# EAGLE design MK1 (EAGLE 9.6.2)

## Sheet 1 of 2
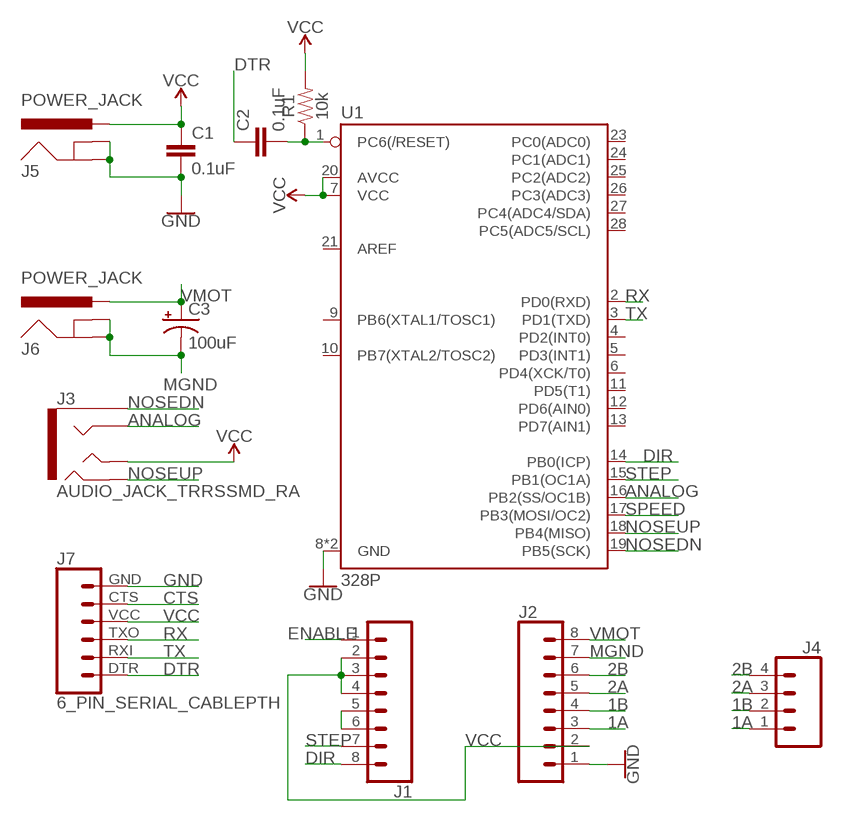
[diagram p0: schematic, sheet 1]

### Parts
C1  0.1uF  0.1UF-KIT-EZ-50V-20%  [CAP-PTH-SMALL-KIT]
C2  0.1uF  0.1UF-KIT-EZ-50V-20%  [CAP-PTH-SMALL-KIT]
C3  100uF  100UF-POLAR-RADIAL-2.5MM-25V-20%  [CPOL-RADIAL-2.5MM-6.5MM]
J1  CONN_08"  [1X08]
J2  CONN_08"  [1X08]
J3  AUDIO_JACK_TRRSSMD_RA  [AUDIO_JACK_3.5MM_TRRS_SMD_RA]
J4  CONN_04PTH  [1X04]
J5  POWER_JACK  [POWER_JACK_PTH]
J6  POWER_JACK  [POWER_JACK_PTH]
J7  6_PIN_SERIAL_CABLEPTH  [FTDI_BASIC]
R1  10k  10KOHM-HORIZ-1/4W-1%  [AXIAL-0.3]
U1  328P  ATMEGA328P_PDIP  [DIP28]

### Nets
1A: J2.3 J4.1
1B: J2.4 J4.2
2A: J2.5 J4.3
2B: J2.6 J4.4
ANALOG: J3.RING1 U1.16(PB2(SS/OC1B))
CTS: J7.CTS
DIR: J1.8 U1.14(PB0(ICP))
DTR: C2.1 J7.DTR
ENABLE: J1.1
GND: C1.2 J2.1 J5.GND J5.GNDBREAK J7.GND U1.8(GND) U1.22(GND)
MGND: C3.2(-) J2.7 J6.GND J6.GNDBREAK
N$1: C2.2 R1.P$1 U1.1(PC6(/RESET))
N$4: J1.5 J1.6
NOSEDN: J3.EARTH U1.19(PB5(SCK))
NOSEUP: J3.RING2 U1.18(PB4(MISO))
RX: J7.TXO U1.2(PD0(RXD))
SPEED: U1.17(PB3(MOSI/OC2))
STEP: J1.7 U1.15(PB1(OC1A))
TX: J7.RXI U1.3(PD1(TXD))
VCC: C1.1 J1.2 J1.3 J1.4 J2.2 J3.TIP J5.PWR J7.VCC R1.P$2 U1.7(VCC) U1.20(AVCC)
VMOT: C3.1(+) J2.8 J6.PWR
Unconnected: U1.4(PD2(INT0)) U1.5(PD3(INT1)) U1.6(PD4(XCK/T0)) U1.9(PB6(XTAL1/TOSC1)) U1.10(PB7(XTAL2/TOSC2)) U1.11(PD5(T1)) U1.12(PD6(AIN0)) U1.13(PD7(AIN1)) U1.21(AREF) U1.23(PC0(ADC0)) U1.24(PC1(ADC1)) U1.25(PC2(ADC2)) U1.26(PC3(ADC3)) U1.27(PC4(ADC4/SDA)) U1.28(PC5(ADC5/SCL))

## Sheet 2 of 2

## Library data of the parts
C1 C2 = SparkFun-Capacitors:0.1UF: 0.1µF ceramic capacitors A capacitor is a passive two-terminal electrical component used to store electrical energy temporarily in an electric field.; PROD_ID: CAP-08370
C3 = SparkFun-Capacitors:100UF-POLAR: 100µF polarized capacitors A capacitor is a passive two-terminal electrical component used to store electrical energy temporarily in an electric field.; PROD_ID: CAP-08439
J1 J2 = SparkFun-Connectors:CONN_08: Multi connection point. Often used as Generic Header-pin footprint for 0.1 inch spaced/style header connections On any of the 0.1 inch spaced packages, you can populate with these: Break Away Headers - Straight <https://www.sparkfun.com/products/116> (PRT-00116) Break Away Male Headers - Right Angle <https://www.sparkfun.com/products/553> (PRT-00553) Female Headers <https://www.sparkfun.com/products/115> (PRT-00115) Break Away Headers - Machine Pin <https://www.sparkfun.com/products/117> (PRT-00117) Break Away Female Headers - Swiss Machine Pin <https://www.sparkfun.com/products/743> (PRT-00743) Arduino Stackable Header - 8 Pin <https://www.sparkfun.com/products/9279> (PRT-09279) For SCREWTERMINALS and SPRING TERMINALS visit here: Screw Terimnals on SparkFun.com <https://www.sparkfun.com/search/results?term=Screw+Terminals> (5mm/3.5mm/2.54mm spacing) This device is also useful as a general connection point to wire up your design to another part of your project. Our various solder wires solder well into these plated through hole pads. Hook-Up Wire - Assortment (Stranded, 22 AWG) <https://www.sparkfun.com/products/11375> (PRT-11375) Hook-Up Wire - Assortment (Solid Core, 22 AWG) <https://www.sparkfun.com/products/11367> (PRT-11367) View the entire wire category on our website here <https://www.sparkfun.com/categories/141> Special notes: Molex polarized connector foot print use with SKU : PRT-08231 with associated crimp pins and housings. 1MM SMD Version SKU: PRT-10208 NOTES ON THE VARIANTS LOCK and LOCK_LONGPADS... This footprint was designed to help hold the alignment of a through-hole component (i.e. 6-pin header) while soldering it into place. You may notice that each hole has been shifted either up or down by 0.005 of an inch from it's more standard position (which is a perfectly straight line). This slight alteration caused the pins (the squares in the middle) to touch the edges of the holes. Because they are alternating, it causes a "brace" to hold the component in place. 0.005 has proven to be the perfect amount of "off-center" position when using our standard breakaway headers. Although looks a little odd when you look at the bare footprint, once you have a header in there, the alteration is very hard to notice. Also,if you push a header all the way into place, it is covered up entirely on the bottom side.; PROD_ID: CONN-08438
J3 = SparkFun-Connectors:AUDIO_JACK_TRRS: Audio Jack - 3.5mm TRRS (SMD) This is a 3.5mm TRRS SMD audio jack. TRRS connectors are the audio-style connectors that you see on some phones, MP3 players and development boards. TRRS stands for “tip, ring, ring, sleeve,” which reflects that this has three conductors and a ground. SparkFun Products: Audio Jack <https://www.sparkfun.com/products/12639> mbed Starter Kit <https://www.sparkfun.com/products/12968> SparkFun TRRS 3.5mm Jack Breakout <https://www.sparkfun.com/products/11570>; PROD_ID: CONN-10676; SF_ID: PRT-12639
J4 = SparkFun-Connectors:CONN_04: Multi connection point. Often used as Generic Header-pin footprint for 0.1 inch spaced/style header connections On any of the 0.1 inch spaced packages, you can populate with these: Break Away Headers - Straight <https://www.sparkfun.com/products/116> (PRT-00116) Break Away Male Headers - Right Angle <https://www.sparkfun.com/products/553> (PRT-00553) Female Headers <https://www.sparkfun.com/products/115> (PRT-00115) Break Away Headers - Machine Pin <https://www.sparkfun.com/products/117> (PRT-00117) Break Away Female Headers - Swiss Machine Pin <https://www.sparkfun.com/products/743> (PRT-00743) For SCREWTERMINALS and SPRING TERMINALS visit here: Screw Terimnals on SparkFun.com <https://www.sparkfun.com/search/results?term=Screw+Terminals> (5mm/3.5mm/2.54mm spacing) This device is also useful as a general connection point to wire up your design to another part of your project. Our various solder wires solder well into these plated through hole pads. Hook-Up Wire - Assortment (Stranded, 22 AWG) <https://www.sparkfun.com/products/11375> (PRT-11375) Hook-Up Wire - Assortment (Solid Core, 22 AWG) <https://www.sparkfun.com/products/11367> (PRT-11367) View the entire wire category on our website here <https://www.sparkfun.com/categories/141> Special notes: Molex polarized connector foot print use with SKU : PRT-08231 with associated crimp pins and housings. 1MM SMD Version SKU: PRT-10208; PROD_ID: CONN-09696
J5 J6 = SparkFun-Connectors:POWER_JACK: Power Jack Connector This is the standard 5.5mm barrel jack for power. The PTH is the most common, proven, reliable, footprint. The Slot footprint only works if the mill layer is transmitted to the PCB fab house so be warned. Here are the connectors we sell at SparkFun: DC Barrel Power Jack/Connector <https://www.sparkfun.com/products/119> (PRT-00119) DC Barrel Power Jack/Connector (SMD) <https://www.sparkfun.com/products/12748> (PRT-12748) DC Barrel Jack Adapter - Breadboard Compatible <https://www.sparkfun.com/products/10811> (PRT-10811) It is used on this SparkFun product (and many, many others): SparkFun RedBoard - Programmed with Arduino <https://www.sparkfun.com/products/12757> (DEV-12757) Also, if you need a mating power supply or connector, please check these out: Wall Adapter Power Supply - 9VDC 650mA <https://www.sparkfun.com/products/298> (TOL-00298) DC Barrel Jack Adapter - Male <https://www.sparkfun.com/products/10287> (PRT-10287); PROD_ID: CONN-08197
J7 = SparkFun-Connectors:6_PIN_SERIAL_CABLE: 6-pin header connection for use with the "FTDI BASIC" pinout - CABLE SIDE. Also known as "Arduino Serial Program Header". This is used on a design to provide a 6-pin connection point for serial communication usually from a USB cable (D+/D-) to these headers (RX/TX). It also has the remaining pins necessary for programming in the Arduino evironment (DTR, GND, and sometimes VCC). Note, this device has "CABLE" in the name. It is intended to be used on a design that usually lives on the end of your USB cable and prvides the converter chip (FTDI232 or FTDI231x) to commnicate serial RX/TX. The "sister" device, named "TARGET" is inteneded to be used on a design that contains a target micro-controller that you wish to program. You can populate with some of these: Female Headers <https://www.sparkfun.com/products/115> (PRT-00115) For reference (or to suit your programming needs) check out these designs: SparkFun FTDI Basic Breakout - 5V <https://www.sparkfun.com/products/9716> (DEV-09716) SparkFun FTDI Basic Breakout - 3.3V <https://www.sparkfun.com/products/9873> (DEV-09873) SparkFun FTDI SmartBasic <https://www.sparkfun.com/products/12935> (DEV-12935) SparkFun Beefy 3 - FTDI Basic Breakout <https://www.sparkfun.com/products/13746> (DEV-13746)
R1 = SparkFun-Resistors:10KOHM: 10kΩ resistor A resistor is a passive two-terminal electrical component that implements electrical resistance as a circuit element. Resistors act to reduce current flow, and, at the same time, act to lower voltage levels within circuits. - Wikipedia; PROD_ID: RES-12183
U1 = SparkFun-IC-Microcontroller:ATMEGA328P_PDIP: Atmel 328P Through hole ATMEGA328P uC used in the Arduino 32kb flash, 1k EEPROM, 2k SRAM Datasheet <http://www.sparkfun.com/datasheets/Components/SMD/ATMega328.pdf> SparkFun Products Storefront component: AVR 28 Pin 20MHz 32K 6A/D - ATMega328P <https://www.sparkfun.com/products/9061> (COM-09061) SparkFun Simon Says - Through-Hole Soldering Kit <https://www.sparkfun.com/products/10547> (KIT-10547) SparkFun Learn to Solder - Simon Says <https://www.sparkfun.com/products/13708> (KIT-13708) SparkFun BigTime Watch Kit <https://www.sparkfun.com/products/11734> (KIT-11734) SparkFun ClockIt <https://www.sparkfun.com/products/10930> (KIT-10930) SparkFun Serial Enabled LCD Kit <https://www.sparkfun.com/products/10097> (LCD-10097) SparkFun Simon Tilts - Through Hole Soldering Kit <https://www.sparkfun.com/products/12634> (KIT-12634) SparkFun Frequency Counter Kit <https://www.sparkfun.com/products/10140> (KIT-10140) FabFM Radio Kit <https://www.sparkfun.com/products/11043> (KIT-11043) SparkFun Binary Blaster Kit <https://www.sparkfun.com/products/12037> (KIT-12037) SparkFun Metro-Gnome <https://www.sparkfun.com/products/9236> (KIT-09236) ATmega328 with Arduino Optiboot (Uno) <https://www.sparkfun.com/products/10524> (DEV-10524); PROD_ID: IC-09136

## Board
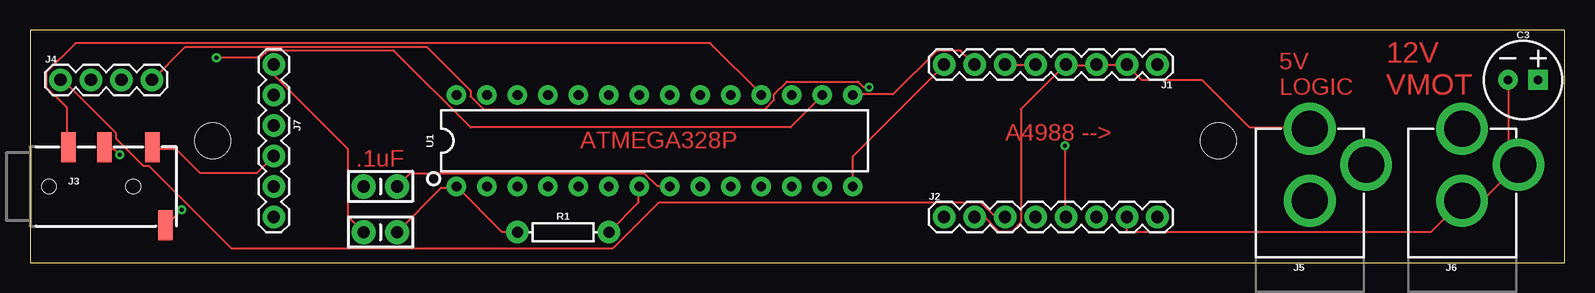
[diagram p1: board, top side]
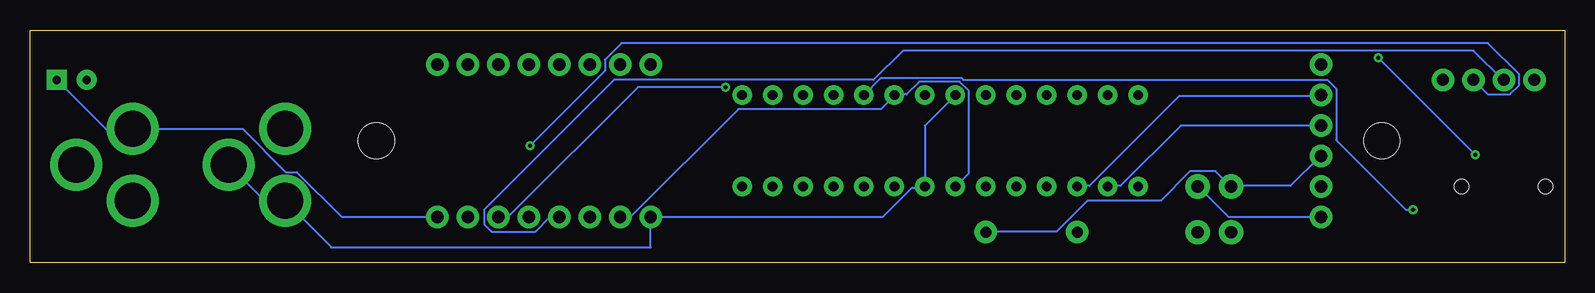
[diagram p2: board, bottom side, seen from below]

Size 127.94 x 19.39 mm. Coordinates in mm from the lower left corner, seen from the top.
Outline: 0,0 127.94,0 127.94,19.39 0,19.39 0,0
Copper layers (1*16): Top 0.035mm / dielectric 1.5mm / Bottom 0.035mm
Design rules "default": minimum track width 6mil, minimum drill 0.35mm, track to track 6mil, track to pad 6mil, pad to pad 6mil, via to via 6mil, smd to smd 6mil, copper to edge 40mil, drill to drill 6mil, minimum pad ring 10mil, minimum via ring 8mil, stop-mask expansion 4mil, vias tented up to drill 0mil, thermal gap 10mil
Holes 3 mm at 99.06,10.16 15.24,10.16

### Footprints (pad centres in the part's own frame; a part is rotated, then mirrored left to right if it is on the bottom)
CAP-PTH-SMALL-KIT = drill 1.016 pad 2.032: 1 -1.397,0; 2 1.397,0
CPOL-RADIAL-2.5MM-6.5MM = drill 0.7 pad 1.651 square: 1 1.25,0 | drill 0.7 pad 1.651: 2 -1.25,0
1X08 = drill 1.016 pad 1.88: 1 0,0; 2 2.54,0; 3 5.08,0; 4 7.62,0; 5 10.16,0; 6 12.7,0; 7 15.24,0; 8 17.78,0
AUDIO_JACK_3.5MM_TRRS_SMD_RA = smd 1.2 x 2.5: EARTH 11.3,-3.25; RING1 6.2,3.25; RING2 3.2,3.25; TIP 10.2,3.25 | hole 1.2: 1.6,0; 8.6,0
1X04 = drill 1.016 pad 1.88: 1 0,0; 2 2.54,0; 3 5.08,0; 4 7.62,0
POWER_JACK_PTH = drill 2.997 pad 4.318: GND 0,7.7; GNDBREAK 4.7,10.7; PWR 0,13.7
FTDI_BASIC = drill 1.016 pad 1.88: CTS 10.16,0; DTR 0,0; GND 12.7,0; RXI 2.54,0; TXO 5.08,0; VCC 7.62,0
AXIAL-0.3 = drill 0.9 pad 1.88: P$1 -3.81,0; P$2 3.81,0
DIP28 = drill 0.813 pad 1.626: 1 -16.51,-3.81; 2 -13.97,-3.81; 3 -11.43,-3.81; 4 -8.89,-3.81; 5 -6.35,-3.81; 6 -3.81,-3.81; 7 -1.27,-3.81; 8 1.27,-3.81; 9 3.81,-3.81; 10 6.35,-3.81; 11 8.89,-3.81; 12 11.43,-3.81; 13 13.97,-3.81; 14 16.51,-3.81; 15 16.51,3.81; 16 13.97,3.81; 17 11.43,3.81; 18 8.89,3.81; 19 6.35,3.81; 20 3.81,3.81; 21 1.27,3.81; 22 -1.27,3.81; 23 -3.81,3.81; 24 -6.35,3.81; 25 -8.89,3.81; 26 -11.43,3.81; 27 -13.97,3.81; 28 -16.51,3.81

### Placement (x,y rotation side)
C1  29.21,6.35 0 top
C2  29.21,2.54 0 top
C3  124.46,15.24 0 top
J1  93.98,16.51 180 top
J2  76.2,3.81 0 top
J3  0,6.35 0 top
J4  2.54,15.24 0 top
J5  106.68,-2.54 0 top
J6  119.38,-2.54 0 top
J7  20.32,16.51 270 top
R1  44.45,2.54 0 top
U1  52.07,10.16 0 top

### Tracks (layer width: path | path; a pad name or v marks a point on that pad's centre or on a via)
1A
  Top 0.152: J2.3 80.47,3.81 79.25,5.03 52.43,5.03 48.62,1.22 16.76,1.22 9.91,8.08 9.45,8.08 7.16,10.36 7.16,10.82 2.74,15.24 J4.1
1B
  Bottom 0.152: J2.4 84.58,3.81 85.8,2.59 89.46,2.59 90.07,3.2 90.07,4.42 79.25,15.24 57.61,15.24 55.17,17.68 7.62,17.68 5.18,15.24 J4.2
2A  (via drill 0.35)
  Top 0.152: v86.26,9.75 86.26,3.81 J2.5
  Bottom 0.152: v86.26,9.75 80.01,16 80.01,16.92 78.64,18.29 6.4,18.29 3.81,15.7 3.81,14.78 4.57,14.02 6.4,14.02 J4.3
2B  (via drill 0.35)
  Top 0.152: v69.95,14.63 69.49,14.63 69.04,15.09 63.09,15.09 62.03,14.02 62.03,13.56 61.27,12.8 37.8,12.8 36.73,13.87 36.73,14.33 33.07,17.98 12.95,17.98 10.21,15.24 J4.4
  Bottom 0.152: J2.6 88.09,3.81 77.27,14.63 v69.95,14.63
ANALOG  (via drill 0.35)
  Top 0.152: v7.47,8.99 7.01,9.45 6.25,9.45 J3.RING1 | v15.54,17.07 19.2,17.07 19.81,17.68 30.33,17.68 36.73,11.28 63.4,11.28 65.99,13.87 U1.16
  Bottom 0.152: v15.54,17.07 v7.47,8.99
DIR
  Top 0.152: U1.14 68.58,8.84 76.2,16.46 J1.8
DTR
  Top 0.152: J7.DTR 20.42,16.46 20.42,15.54 26.52,9.45 26.52,3.81 27.74,2.59 C2.1
GND
  Top 0.152: U1.8 53.34,6.4 52.27,6.4 51.21,7.47 31.7,7.47 30.63,6.4 C1.2
  Bottom 0.152: J5.GNDBREAK 108.38,5.16 J5.GND 102.87,1.35 102.87,1.27 76.2,1.27 J2.1 56.84,3.81 54.41,6.25 53.34,6.25 U1.8 53.34,11.43 U1.22 | J7.GND 28.04,3.81 30.48,6.25 C1.2
MGND
  Top 0.152: C3.2 123.21,9.03 J6.GNDBREAK 121.08,5.16 J6.GND 116.76,2.54 91.44,2.54 J2.7
N$1
  Top 0.152: C2.2 30.63,2.59 34.29,6.25 35.51,6.25 U1.1 39.32,2.59 40.54,2.59 R1.P$1
N$4
  Top 0.152: J1.6 81.38,16.46 83.82,16.46 J1.5
NOSEDN  (via drill 0.35)
  Top 0.152: v12.65,4.42 11.43,3.2 J3.EARTH
  Bottom 0.152: v12.65,4.42 13.26,4.42 19.05,10.21 19.05,14.48 19.81,15.24 50.14,15.24 50.29,15.39 57,15.39 U1.19
NOSEUP
  Top 0.152: J3.RING2 3.05,9.6 3.05,12.95 1.37,14.63 1.37,15.85 3.81,18.29 56.69,18.29 60.96,14.02 U1.18
RX
  Bottom 0.152: J7.TXO 32,11.43 37.03,6.4 38.1,6.4 U1.2
STEP
  Top 0.152: J1.7 77.57,17.68 75.59,17.68 71.93,14.02 68.58,14.02 U1.15
TX
  Bottom 0.152: U1.3 40.54,6.4 39.62,6.4 32.16,13.87 20.42,13.87 J7.RXI
VCC
  Top 0.152: 91.44,16.46 89,16.46 J1.3 88.85,16.46 86.41,16.46 J1.4 86.26,16.46 82.6,12.8 82.6,3.35 81.84,2.59 80.77,2.59 79.55,3.81 J2.2 | 91.44,16.46 92.66,15.24 97.69,15.24 101.65,11.28 106.68,11.28 J5.PWR | 91.44,16.46 J1.2 | R1.P$2 50.75,5.03 50.75,6.25 U1.7 | J7.VCC 18.9,7.47 14.17,7.47 12.19,9.45 10.21,9.45 J3.TIP
  Bottom 0.152: U1.7 49.68,7.47 49.68,14.33 50.44,15.09 53.8,15.09 54.86,14.02 55.78,14.02 U1.20 55.93,13.87 57,12.8 68.89,12.8 77.88,3.81 J2.2 | J7.VCC 20.42,8.84 22.86,6.4 27.74,6.4 C1.1 27.89,6.4 29.11,7.62 31.24,7.62 33.68,5.18 39.78,5.18 42.37,2.59 48.16,2.59 R1.P$2
VMOT
  Bottom 0.152: C3.1 121.63,11.16 J6.PWR 110.22,11.16 106.61,7.55 105.69,7.55 101.95,3.81 J2.8

### Text on the board
Top: 5V / LOGIC | 12V / VMOT | ATMEGA328P | A4988 --> | .1uF